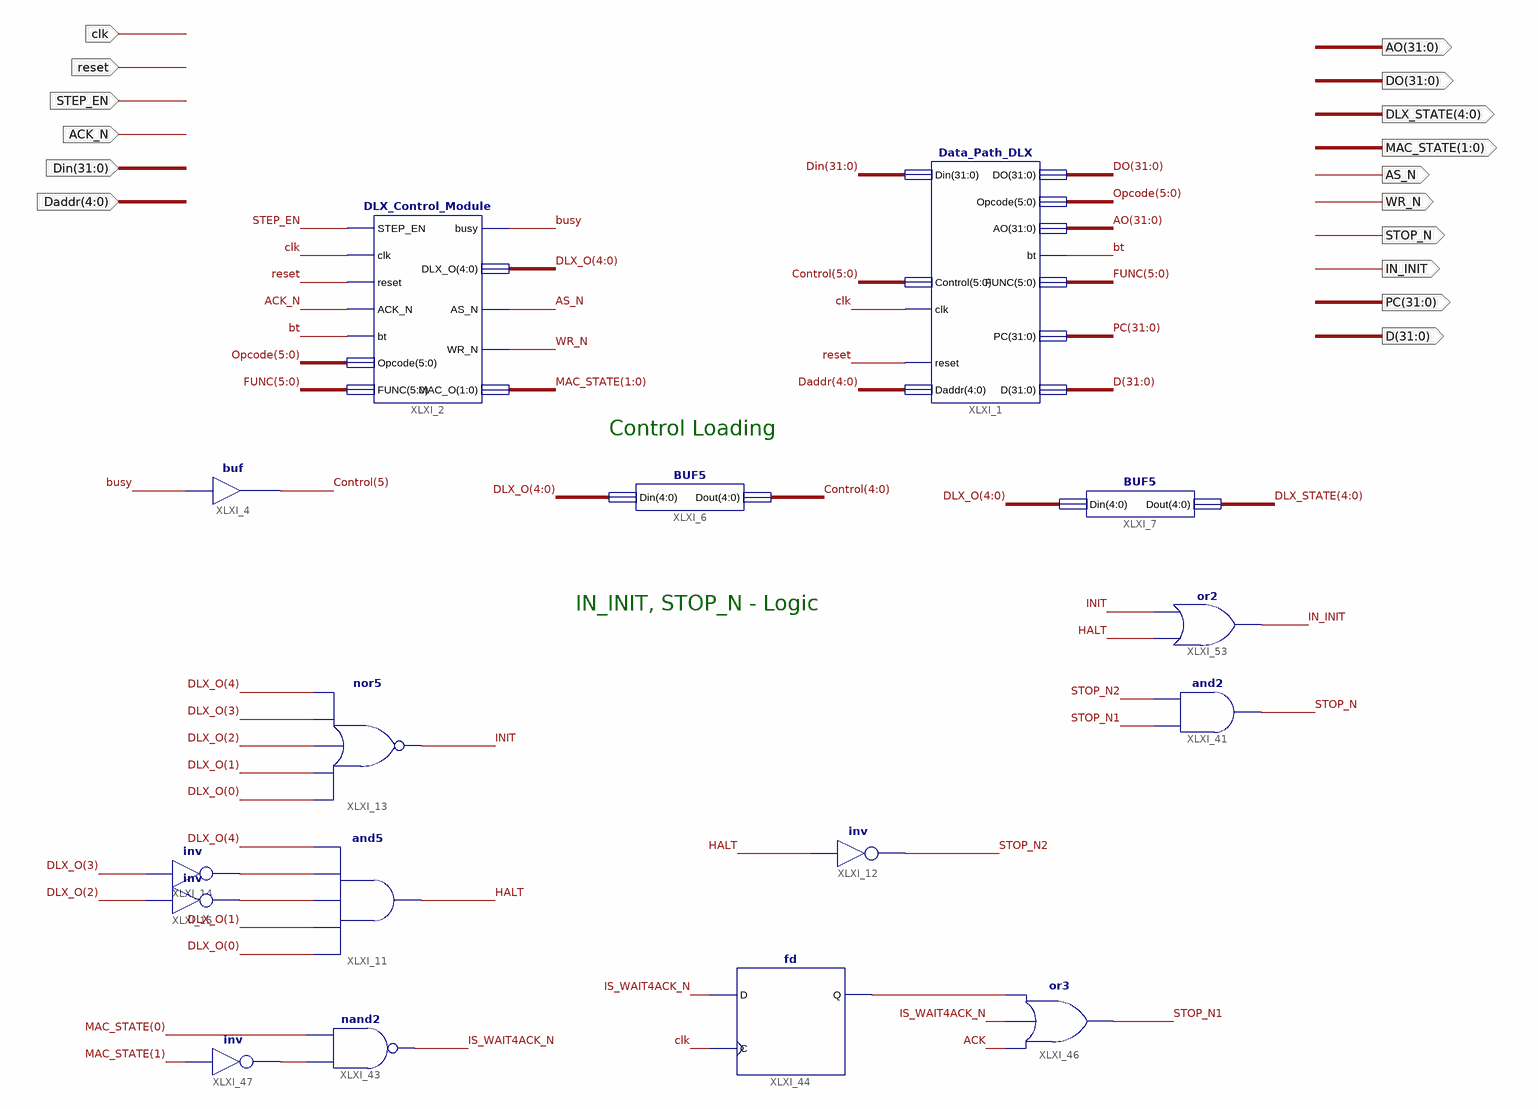
[diagram p0: schematic sheet 1]
// Xilinx ISE schematic DLX_MACHINE.sch (spartan6) as structural Verilog: 16 symbols, 17 ports
module DLX_MACHINE (
  input  clk,
  input  reset,
  input  STEP_EN,
  input  ACK_N,
  input  [31:0] Din,
  input  [4:0] Daddr,
  output [4:0] DLX_STATE,
  output AS_N,
  output WR_N,
  output [31:0] AO,
  output [31:0] DO,
  output [1:0] MAC_STATE,
  output INIT,
  output STOP_N,
  output [31:0] PC,
  output [31:0] D,
  output IN_INIT
);

  wire ACK, bt, busy, HALT, IS_WAIT4ACK_N, STOP_N1, STOP_N2, XLXN_15, XLXN_16, XLXN_112, XLXN_116;
  wire [4:0] DLX_O;
  wire [5:0] Control, FUNC, Opcode;

  DLX_Control_Module XLXI_2 (
    .STEP_EN(STEP_EN), .clk(clk), .reset(reset), .ACK_N(ACK_N), .bt(bt), .Opcode(Opcode), .FUNC(FUNC),
    .busy(busy), .DLX_O(DLX_O), .AS_N(AS_N), .WR_N(WR_N), .MAC_O(MAC_STATE));
  Data_Path_DLX XLXI_1 (
    .clk(clk), .Din(Din), .reset(reset), .Control(Control), .DO(DO), .PC(PC), .Opcode(Opcode), .AO(AO),
    .bt(bt), .FUNC(FUNC), .Daddr(Daddr), .D(D));
  and XLXI_11 (HALT, DLX_O[0], DLX_O[1], XLXN_16, XLXN_15, DLX_O[4]);
  nor XLXI_13 (INIT, DLX_O[0], DLX_O[1], DLX_O[2], DLX_O[3], DLX_O[4]);
  not XLXI_14 (XLXN_15, DLX_O[3]);
  not XLXI_15 (XLXN_16, DLX_O[2]);
  not XLXI_12 (STOP_N2, HALT);
  nand XLXI_43 (IS_WAIT4ACK_N, XLXN_112, MAC_STATE[0]);
  not XLXI_47 (XLXN_112, MAC_STATE[1]);
  fd XLXI_44 (.C(clk), .D(IS_WAIT4ACK_N), .Q(XLXN_116));
  or XLXI_46 (STOP_N1, ACK, IS_WAIT4ACK_N, XLXN_116);
  or XLXI_53 (IN_INIT, HALT, INIT);
  buf XLXI_4 (Control[5], busy);
  BUF5 XLXI_6 (.Din(DLX_O), .Dout(Control[4:0]));
  BUF5 XLXI_7 (.Din(DLX_O), .Dout(DLX_STATE));
  and XLXI_41 (STOP_N, STOP_N1, STOP_N2);

  // Notes on the sheet:
  //   Control Loading
  //   IN_INIT, STOP_N - Logic
endmodule
